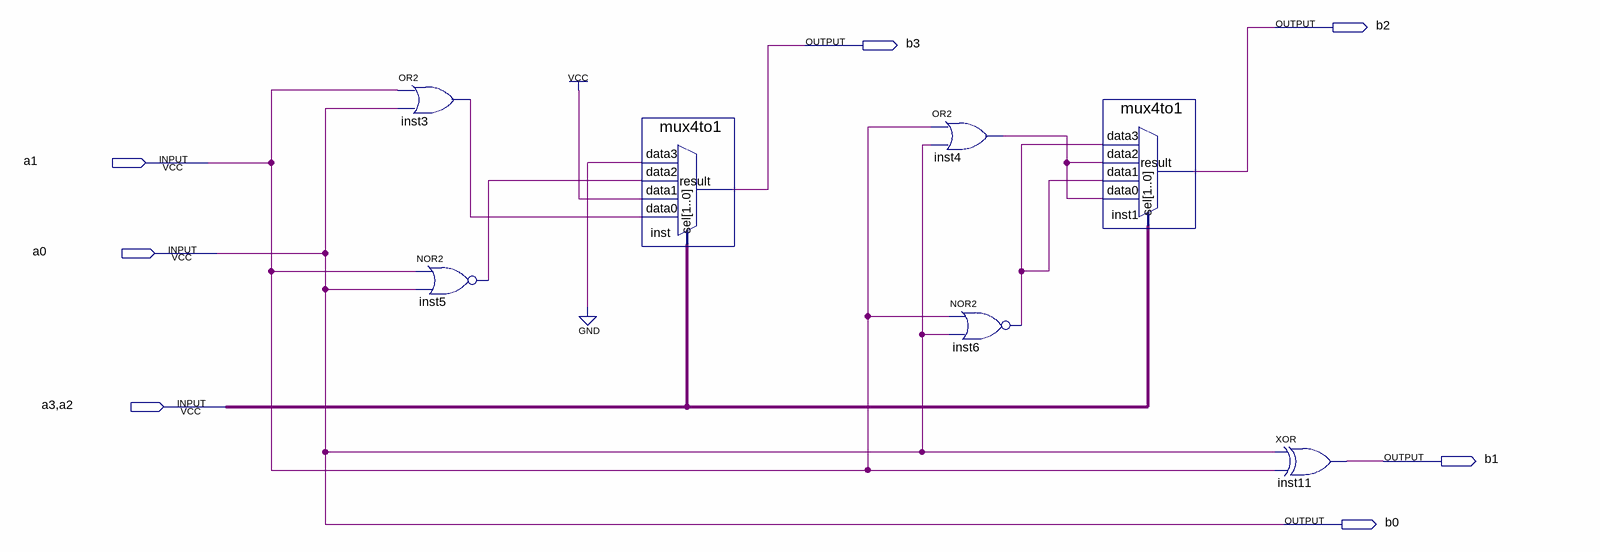
[diagram p0: schematic sheet]
// Quartus schematic Negator.bdf as structural Verilog: 7 symbols, 7 pins
module Negator (
  input  a1,
  input  a0,
  input  a3,
  input  a2,
  output b2,
  output b3,
  output b1,
  output b0
);

  wire inst3_out, inst4_out, inst5_out, inst6_out;

  or inst3 (inst3_out, a1, a0);
  nor inst5 (inst5_out, a1, a0);
  mux4to1 inst (.data3(1'b0), .data2(inst5_out), .data1(1'b1), .data0(inst3_out), .sel({a3, a2}), .result(b3));
  or inst4 (inst4_out, a1, a0);
  nor inst6 (inst6_out, a1, a0);
  mux4to1 inst1 (
    .data3(inst6_out), .data2(inst4_out), .data1(inst6_out), .data0(inst4_out), .sel({a3, a2}), .result(b2));
  xor inst11 (b1, a0, a1);

  assign b0 = a0;
endmodule
